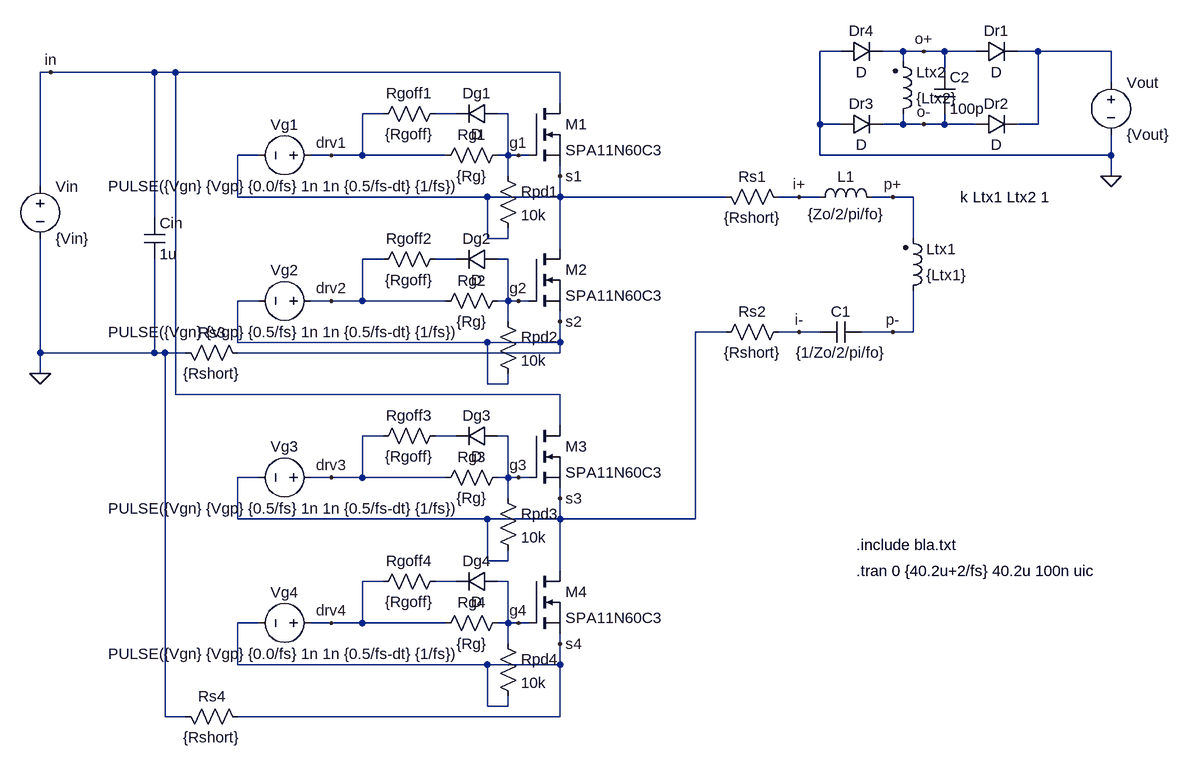
[diagram p0: schematic bla.asc]
bla.asc, the LTspice schematic file:
Version 4
SHEET 1 932 872
WIRE 416 -192 384 -192
WIRE 512 -192 480 -192
WIRE 544 -192 512 -192
WIRE 576 -192 544 -192
WIRE 624 -192 576 -192
WIRE 720 -192 688 -192
WIRE 832 -192 720 -192
WIRE 512 -176 512 -192
WIRE -800 -160 -816 -160
WIRE -640 -160 -800 -160
WIRE -608 -160 -640 -160
WIRE -16 -160 -608 -160
WIRE 576 -160 576 -192
WIRE 832 -144 832 -192
WIRE -16 -112 -16 -160
WIRE -288 -96 -320 -96
WIRE -176 -96 -208 -96
WIRE -96 -96 -112 -96
WIRE 384 -80 384 -192
WIRE 416 -80 384 -80
WIRE 512 -80 512 -96
WIRE 512 -80 480 -80
WIRE 544 -80 512 -80
WIRE 576 -80 576 -96
WIRE 576 -80 544 -80
WIRE 624 -80 576 -80
WIRE 720 -80 720 -192
WIRE 720 -80 688 -80
WIRE -480 -32 -512 -32
WIRE -368 -32 -400 -32
WIRE -320 -32 -320 -96
WIRE -320 -32 -368 -32
WIRE -192 -32 -320 -32
WIRE -96 -32 -96 -96
WIRE -96 -32 -112 -32
WIRE -80 -32 -96 -32
WIRE -64 -32 -80 -32
WIRE 384 -32 384 -80
WIRE 832 -32 832 -64
WIRE 832 -32 384 -32
WIRE -96 0 -96 -32
WIRE -16 0 -16 -16
WIRE 832 0 832 -32
WIRE -816 16 -816 -160
WIRE -512 32 -512 -32
WIRE -128 32 -512 32
WIRE -16 32 -16 0
WIRE -16 32 -128 32
WIRE 240 32 -16 32
WIRE 352 32 320 32
WIRE 384 32 352 32
WIRE 496 32 464 32
WIRE 528 32 496 32
WIRE -640 64 -640 -160
WIRE -128 96 -128 32
WIRE -96 96 -96 80
WIRE -96 96 -128 96
WIRE 528 96 528 32
WIRE -16 112 -16 32
WIRE -288 128 -320 128
WIRE -176 128 -208 128
WIRE -96 128 -112 128
WIRE -480 192 -512 192
WIRE -368 192 -400 192
WIRE -320 192 -320 128
WIRE -320 192 -368 192
WIRE -192 192 -320 192
WIRE -96 192 -96 128
WIRE -96 192 -112 192
WIRE -80 192 -96 192
WIRE -64 192 -80 192
WIRE -96 224 -96 192
WIRE -16 224 -16 208
WIRE 240 240 192 240
WIRE 352 240 320 240
WIRE 384 240 352 240
WIRE 496 240 448 240
WIRE 528 240 528 176
WIRE 528 240 496 240
WIRE -512 256 -512 192
WIRE -128 256 -512 256
WIRE -16 256 -16 224
WIRE -16 256 -128 256
WIRE -816 272 -816 96
WIRE -640 272 -640 128
WIRE -640 272 -816 272
WIRE -624 272 -640 272
WIRE -592 272 -624 272
WIRE -16 272 -16 256
WIRE -16 272 -512 272
WIRE -816 304 -816 272
WIRE -128 320 -128 256
WIRE -96 320 -96 304
WIRE -96 320 -128 320
WIRE -608 336 -608 -160
WIRE -16 336 -608 336
WIRE -16 384 -16 336
WIRE -288 400 -320 400
WIRE -176 400 -208 400
WIRE -96 400 -112 400
WIRE -480 464 -512 464
WIRE -368 464 -400 464
WIRE -320 464 -320 400
WIRE -320 464 -368 464
WIRE -192 464 -320 464
WIRE -96 464 -96 400
WIRE -96 464 -112 464
WIRE -80 464 -96 464
WIRE -64 464 -80 464
WIRE -96 496 -96 464
WIRE -16 496 -16 480
WIRE -512 528 -512 464
WIRE -128 528 -512 528
WIRE -16 528 -16 496
WIRE -16 528 -128 528
WIRE 192 528 192 240
WIRE 192 528 -16 528
WIRE -128 592 -128 528
WIRE -96 592 -96 576
WIRE -96 592 -128 592
WIRE -16 608 -16 528
WIRE -288 624 -320 624
WIRE -176 624 -208 624
WIRE -96 624 -112 624
WIRE -480 688 -512 688
WIRE -368 688 -400 688
WIRE -320 688 -320 624
WIRE -320 688 -368 688
WIRE -192 688 -320 688
WIRE -96 688 -96 624
WIRE -96 688 -112 688
WIRE -80 688 -96 688
WIRE -64 688 -80 688
WIRE -96 720 -96 688
WIRE -16 720 -16 704
WIRE -512 752 -512 688
WIRE -128 752 -512 752
WIRE -16 752 -16 720
WIRE -16 752 -128 752
WIRE -128 816 -128 752
WIRE -96 816 -96 800
WIRE -96 816 -128 816
WIRE -624 832 -624 272
WIRE -592 832 -624 832
WIRE -16 832 -16 752
WIRE -16 832 -512 832
FLAG -816 304 0
FLAG 352 32 i+
FLAG 544 -192 o+
FLAG 544 -80 o-
FLAG 352 240 i-
FLAG -16 0 s1
FLAG -16 224 s2
FLAG -80 192 g2
FLAG -80 464 g3
FLAG -80 688 g4
FLAG -16 720 s4
FLAG -16 496 s3
FLAG -80 -32 g1
FLAG -800 -160 in
FLAG 832 0 0
FLAG 496 32 p+
FLAG 496 240 p-
FLAG -368 -32 drv1
FLAG -368 192 drv2
FLAG -368 464 drv3
FLAG -368 688 drv4
SYMBOL ind 368 48 R270
WINDOW 0 32 56 VTop 2
WINDOW 3 5 56 VBottom 2
SYMATTR InstName L1
SYMATTR Value {Zo/2/pi/fo}
SYMATTR SpiceLine Rser={RLs}
SYMBOL cap 384 256 R270
WINDOW 0 32 32 VTop 2
WINDOW 3 0 32 VBottom 2
SYMATTR InstName C1
SYMATTR Value {1/Zo/2/pi/fo}
SYMATTR SpiceLine Rpar=1meg
SYMBOL diode 624 -176 R270
WINDOW 0 32 32 VTop 2
WINDOW 3 0 32 VBottom 2
SYMATTR InstName Dr1
SYMBOL diode 416 -64 R270
WINDOW 0 32 32 VTop 2
WINDOW 3 0 32 VBottom 2
SYMATTR InstName Dr3
SYMBOL diode 624 -64 R270
WINDOW 0 32 32 VTop 2
WINDOW 3 0 32 VBottom 2
SYMATTR InstName Dr2
SYMBOL diode 416 -176 R270
WINDOW 0 32 32 VTop 2
WINDOW 3 0 32 VBottom 2
SYMATTR InstName Dr4
SYMBOL voltage 832 -160 R0
WINDOW 123 0 0 Left 0
WINDOW 39 0 0 Left 0
SYMATTR InstName Vout
SYMATTR Value {Vout}
SYMBOL res 336 224 R90
WINDOW 0 0 56 VBottom 2
WINDOW 3 32 56 VTop 2
SYMATTR InstName Rs2
SYMATTR Value {Rshort}
SYMBOL res 224 16 M90
WINDOW 0 0 56 VBottom 2
WINDOW 3 32 56 VTop 2
SYMATTR InstName Rs1
SYMATTR Value {Rshort}
SYMBOL cap 560 -160 R0
SYMATTR InstName C2
SYMATTR Value 100p
SYMATTR SpiceLine Rser=10 Rpar=1meg
SYMBOL nmos -64 -112 R0
SYMATTR InstName M1
SYMATTR Value SPA11N60C3
SYMBOL voltage -384 -32 R90
WINDOW 0 -32 56 VBottom 2
WINDOW 3 32 56 VTop 2
WINDOW 123 0 0 Left 0
WINDOW 39 0 0 Left 0
SYMATTR InstName Vg1
SYMATTR Value PULSE({Vgn} {Vgp} {0.0/fs} 1n 1n {0.5/fs-dt} {1/fs})
SYMBOL res -96 -48 R90
WINDOW 0 0 56 VBottom 2
WINDOW 3 32 56 VTop 2
SYMATTR InstName Rg1
SYMATTR Value {Rg}
SYMBOL res -96 176 R90
WINDOW 0 0 56 VBottom 2
WINDOW 3 32 56 VTop 2
SYMATTR InstName Rg2
SYMATTR Value {Rg}
SYMBOL voltage -816 0 R0
SYMATTR InstName Vin
SYMATTR Value {Vin}
SYMBOL cap -656 64 R0
SYMATTR InstName Cin
SYMATTR Value 1u
SYMBOL nmos -64 112 R0
SYMATTR InstName M2
SYMATTR Value SPA11N60C3
SYMBOL res -112 -16 R0
SYMATTR InstName Rpd1
SYMATTR Value 10k
SYMBOL res -112 208 R0
SYMATTR InstName Rpd2
SYMATTR Value 10k
SYMBOL nmos -64 384 R0
SYMATTR InstName M3
SYMATTR Value SPA11N60C3
SYMBOL res -96 448 R90
WINDOW 0 0 56 VBottom 2
WINDOW 3 32 56 VTop 2
SYMATTR InstName Rg3
SYMATTR Value {Rg}
SYMBOL res -96 672 R90
WINDOW 0 0 56 VBottom 2
WINDOW 3 32 56 VTop 2
SYMATTR InstName Rg4
SYMATTR Value {Rg}
SYMBOL nmos -64 608 R0
SYMATTR InstName M4
SYMATTR Value SPA11N60C3
SYMBOL res -112 480 R0
SYMATTR InstName Rpd3
SYMATTR Value 10k
SYMBOL res -112 704 R0
SYMATTR InstName Rpd4
SYMATTR Value 10k
SYMBOL res -608 256 M90
WINDOW 0 0 56 VBottom 2
WINDOW 3 32 56 VTop 2
SYMATTR InstName Rs3
SYMATTR Value {Rshort}
SYMBOL res -608 816 M90
WINDOW 0 0 56 VBottom 2
WINDOW 3 32 56 VTop 2
SYMATTR InstName Rs4
SYMATTR Value {Rshort}
SYMBOL diode -112 -112 R90
WINDOW 0 0 32 VBottom 2
WINDOW 3 32 32 VTop 2
SYMATTR InstName Dg1
SYMBOL diode -112 384 R90
WINDOW 0 0 32 VBottom 2
WINDOW 3 32 32 VTop 2
SYMATTR InstName Dg3
SYMBOL diode -112 112 R90
WINDOW 0 0 32 VBottom 2
WINDOW 3 32 32 VTop 2
SYMATTR InstName Dg2
SYMBOL diode -112 608 R90
WINDOW 0 0 32 VBottom 2
WINDOW 3 32 32 VTop 2
SYMATTR InstName Dg4
SYMBOL res -192 -112 R90
WINDOW 0 0 56 VBottom 2
WINDOW 3 32 56 VTop 2
SYMATTR InstName Rgoff1
SYMATTR Value {Rgoff}
SYMBOL res -192 112 R90
WINDOW 0 0 56 VBottom 2
WINDOW 3 32 56 VTop 2
SYMATTR InstName Rgoff2
SYMATTR Value {Rgoff}
SYMBOL res -192 384 R90
WINDOW 0 0 56 VBottom 2
WINDOW 3 32 56 VTop 2
SYMATTR InstName Rgoff3
SYMATTR Value {Rgoff}
SYMBOL res -192 608 R90
WINDOW 0 0 56 VBottom 2
WINDOW 3 32 56 VTop 2
SYMATTR InstName Rgoff4
SYMATTR Value {Rgoff}
SYMBOL voltage -384 192 R90
WINDOW 0 -32 56 VBottom 2
WINDOW 3 32 56 VTop 2
WINDOW 123 0 0 Left 0
WINDOW 39 0 0 Left 0
SYMATTR InstName Vg2
SYMATTR Value PULSE({Vgn} {Vgp} {0.5/fs} 1n 1n {0.5/fs-dt} {1/fs})
SYMBOL voltage -384 464 R90
WINDOW 0 -32 56 VBottom 2
WINDOW 3 32 56 VTop 2
WINDOW 123 0 0 Left 0
WINDOW 39 0 0 Left 0
SYMATTR InstName Vg3
SYMATTR Value PULSE({Vgn} {Vgp} {0.5/fs} 1n 1n {0.5/fs-dt} {1/fs})
SYMBOL voltage -384 688 R90
WINDOW 0 -32 56 VBottom 2
WINDOW 3 32 56 VTop 2
WINDOW 123 0 0 Left 0
WINDOW 39 0 0 Left 0
SYMATTR InstName Vg4
SYMATTR Value PULSE({Vgn} {Vgp} {0.0/fs} 1n 1n {0.5/fs-dt} {1/fs})
SYMBOL ind2 512 192 M180
WINDOW 0 36 80 Left 2
WINDOW 3 36 40 Left 2
SYMATTR InstName Ltx1
SYMATTR Value {Ltx1}
SYMATTR Type ind
SYMBOL ind2 496 -80 M180
WINDOW 0 36 80 Left 2
WINDOW 3 36 40 Left 2
SYMATTR InstName Ltx2
SYMATTR Value {Ltx2}
SYMATTR Type ind
TEXT 440 608 Left 2 !.tran 0 {40.2u+2/fs} 40.2u 100n uic
TEXT 440 568 Left 2 !.include bla.txt
TEXT 600 32 Left 2 !k Ltx1 Ltx2 1

The netlist it stands for:
* bla.asc
L1 i+ p+ {Zo/2/pi/fo} Rser={RLs}
C1 i- p- {1/Zo/2/pi/fo} Rpar=1meg
Dr1 o+ N001 D
Dr3 0 o- D
Dr2 o- N001 D
Dr4 0 o+ D
Vout N001 0 {Vout}
Rs2 i- s3 {Rshort}
Rs1 s1 i+ {Rshort}
C2 o+ o- 100p Rser=10 Rpar=1meg
M1 in g1 s1 s1 SPA11N60C3
Vg1 drv1 s1 PULSE({Vgn} {Vgp} {0.0/fs} 1n 1n {0.5/fs-dt} {1/fs})
Rg1 g1 drv1 {Rg}
Rg2 g2 drv2 {Rg}
Vin in 0 {Vin}
Cin in 0 1u
M2 s1 g2 s2 s2 SPA11N60C3
Rpd1 g1 s1 10k
Rpd2 g2 s2 10k
M3 in g3 s3 s3 SPA11N60C3
Rg3 g3 drv3 {Rg}
Rg4 g4 drv4 {Rg}
M4 s3 g4 s4 s4 SPA11N60C3
Rpd3 g3 s3 10k
Rpd4 g4 s4 10k
Rs3 0 s2 {Rshort}
Rs4 0 s4 {Rshort}
Dg1 g1 N002 D
Dg3 g3 N004 D
Dg2 g2 N003 D
Dg4 g4 N005 D
Rgoff1 N002 drv1 {Rgoff}
Rgoff2 N003 drv2 {Rgoff}
Rgoff3 N004 drv3 {Rgoff}
Rgoff4 N005 drv4 {Rgoff}
Vg2 drv2 s2 PULSE({Vgn} {Vgp} {0.5/fs} 1n 1n {0.5/fs-dt} {1/fs})
Vg3 drv3 s3 PULSE({Vgn} {Vgp} {0.5/fs} 1n 1n {0.5/fs-dt} {1/fs})
Vg4 drv4 s4 PULSE({Vgn} {Vgp} {0.0/fs} 1n 1n {0.5/fs-dt} {1/fs})
Ltx1 p- p+ {Ltx1}
Ltx2 o- o+ {Ltx2}
.model D D
.lib standard.dio
.model NMOS NMOS
.model PMOS PMOS
.lib standard.mos
.tran 0 {40.2u+2/fs} 40.2u 100n uic
.include bla.txt
k Ltx1 Ltx2 1
.backanno
.end

* Results of the author's LTspice run, read from the files saved beside the schematic
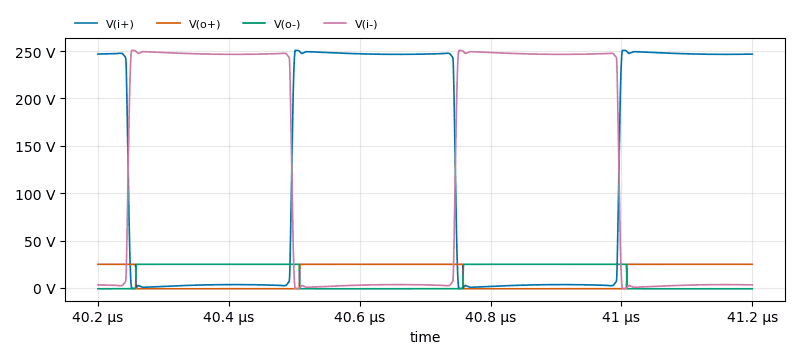
[diagram p1: Transient Analysis of bla.asc, plotted from the saved traces]
* Transient Analysis, 1 run:
*   V(i+): min -719 mV, max 250.7 V, average 125 V, rms 174.2 V, last 246.8 V
*   V(o+): min -950.9 mV, max 24.95 V, average 11.99 V, rms 17.63 V, last 24.95 V
*   V(o-): min -950.7 mV, max 24.95 V, average 12.01 V, rms 17.64 V, last -948.3 mV
*   V(i-): min -722.4 mV, max 250.7 V, average 125 V, rms 174.1 V, last 3.186 V